# EAGLE schematic APC_100 (EAGLE 7.1.0)
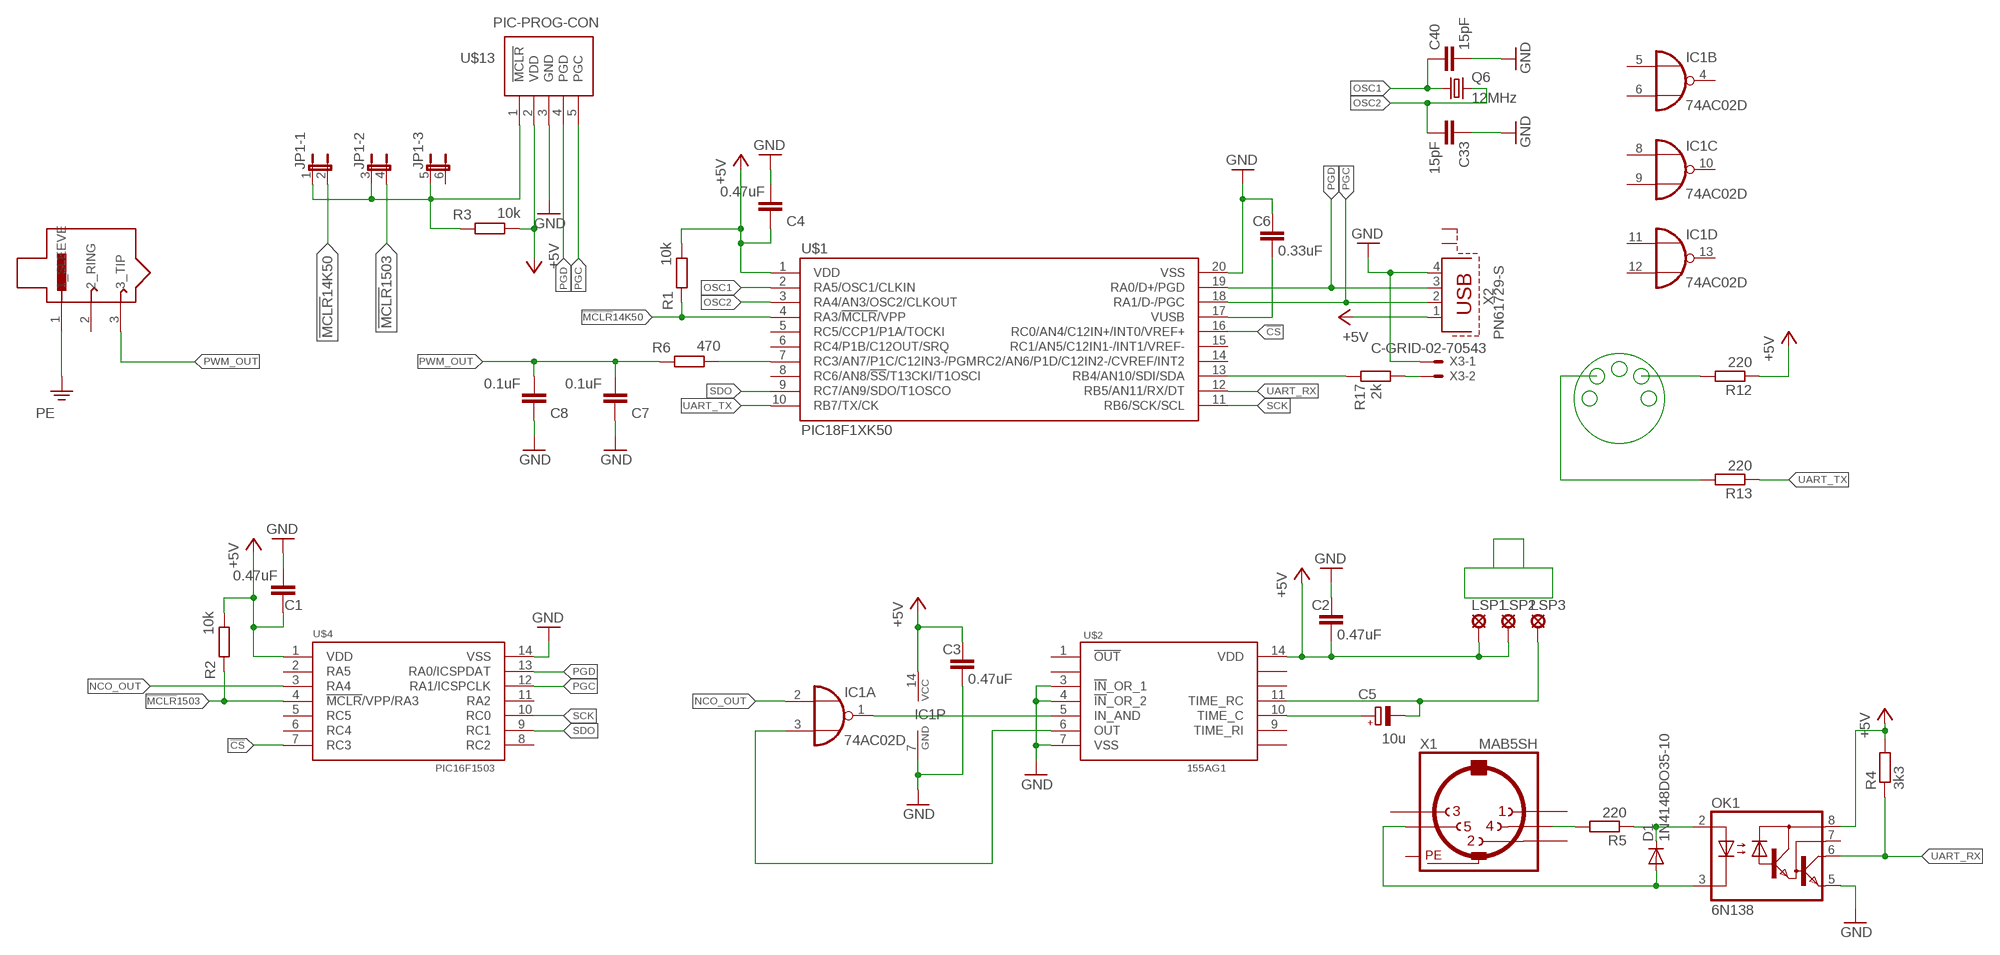
[diagram p0: schematic, sheet 1]

## Parts
C1  0.47uF  C-1206  [C1206]
C2  0.47uF  C-1206  [C1206]
C3  0.47uF  C-1206  [C1206]
C4  0.47uF  C-1206  [C1206]
C5  10u  CPOL-EUCT3528  [CT3528]
C6  0.33uF  C-1206  [C1206]
C7  0.1uF  C-1206  [C1206]
C8  0.1uF  C-1206  [C1206]
C33  15pF  C-1206  [C1206]
C40  15pF  C-1206  [C1206]
D1  1N4148DO35-10  [DO35-10]
IC1  74AC02D  [SO14]
JP1  JP3QE  [JP3Q]
LSP1  SE13  [SE13]
LSP2  SE13  [SE13]
LSP3  SE13  [SE13]
OK1  6N138  [DIL08]
Q6  12MHz  CRYSTALHC49S  [HC49/S]
R1  10k  R-EU_M1206  [M1206]
R2  10k  R-EU_M1206  [M1206]
R3  10k  R-EU_M1206  [M1206]
R4  3k3  R-EU_M1206  [M1206]
R5  220  R-EU_M1206  [M1206]
R6  470  R-EU_M1206  [M1206]
R12  220  R-EU_M1206  [M1206]
R13  220  R-EU_M1206  [M1206]
R17  2k  R-EU_M1206  [M1206]
U$1  PIC18F1XK50  [SOIC20]
U$2  155AG1  [DIP14]
U$3  STEREO_JACK_6.3  [JACK6.3_MAMA_STEREO]
U$4  PIC16F1503  [SO14]
U$13  PIC-PROG-CON  [PIC-PROG-CON]
X1  MAB5SH  [MAB5SH]
X2  PN61729-S  [PN61729-S]
X3  C-GRID-02-70543  [70543-02]

## Nets
!CS: U$1.16(RC0/AN4/C12IN+/INT0/VREF+) U$4.7(RC3)
!MCLR!14K50 [net12]: JP1.2 R1.1 U$1.4(RA3/!MCLR!/VPP)
!MCLR!1503 [net12]: JP1.4 R2.1 U$4.4(!MCLR!/VPP/RA3)
+5V: C1.2 C2.1 C3.2 C4.2 IC1.14(P:VCC) LSP1.MP LSP2.MP OK1.8(VCC) R1.2 R2.2 R3.2 R4.2 R12.1 U$1.1(VDD) U$2.14(VDD) U$4.1(VDD) U$13.2(VDD) X2.1
FIRST_SOUND: IC1.1(A:O) U$2.5(IN_AND)
GND [net8]: C1.1 C2.2 C3.1 C4.1 C6.2 C7.2 C8.2 C33.1 C40.2 IC1.7(P:GND) OK1.5(GND) U$1.20(VSS) U$2.3(!IN!_OR_1) U$2.4(!IN!_OR_2) U$2.7(VSS) U$4.14(VSS) U$13.3(GND) X2.4 X3.1
MCLR [net8]: JP1.1 JP1.3 JP1.5 R3.1 U$13.1(!MCLR)
N$1: C5.+ U$2.10(TIME_C)
N$2: IC1.3(A:I1) U$2.6(OUT)
N$3: C5.- LSP3.MP U$2.11(TIME_RC)
N$4: D1.C OK1.2(A) R5.1
N$5: R5.2 X1.4
N$6: D1.A OK1.3(C) X1.5
N$8: C6.1 U$1.17(VUSB)
N$9 [net16]: R17.1 X3.2
N$10: R17.2 U$1.13(RB4/AN10/SDI/SDA)
N$11: R6.2 U$1.7(RC3/AN7/P1C/C12IN3-/PGM)
N$22: R12.2
N$23: R13.2
NCO_OUT: IC1.2(A:I0) U$4.3(RA4)
OSC1 [net8]: C40.1 Q6.1 U$1.2(RA5/OSC1/CLKIN)
OSC2 [net8]: C33.2 Q6.2 U$1.3(RA4/AN3/OSC2/CLKOUT)
PE: U$3.1(1_SLEEVE)
PGC [net8]: U$1.18(RA1/D-/PGC) U$4.12(RA1/ICSPCLK) U$13.5(PGC) X2.2
PGD [net8]: U$1.19(RA0/D+/PGD) U$4.13(RA0/ICSPDAT) U$13.4(PGD) X2.3
PWM_OUT: C7.1 C8.1 R6.1 U$3.3(3_TIP)
SCK: U$1.11(RB6/SCK/SCL) U$4.10(RC0)
SDO: U$1.9(RC7/AN9/SDO/T1OSCO) U$4.9(RC1)
UART_RX: OK1.6(VO) R4.1 U$1.12(RB5/AN11/RX/DT)
UART_TX: R13.1 U$1.10(RB7/TX/CK)
Unconnected: IC1.4(B:O) IC1.5(B:I0) IC1.6(B:I1) IC1.8(C:I0) IC1.9(C:I1) IC1.10(C:O) IC1.11(D:I0) IC1.12(D:I1) IC1.13(D:O) JP1.6 OK1.7(VB) U$1.5(RC5/CCP1/P1A/TOCKI) U$1.6(RC4/P1B/C12OUT/SRQ) U$1.8(RC6/AN8/!SS!/T13CKI/T1OSCI) U$1.14(RC2/AN6/P1D/C12IN2-/CVREF/INT2) U$1.15(RC1/AN5/C12IN1-/INT1/VREF-) U$2.1(!OUT!) U$2.2(NC) U$2.8(NC) U$2.9(TIME_RI) U$2.12(NC) U$2.13(NC) U$3.2(2_RING) U$4.2(RA5) U$4.5(RC5) U$4.6(RC4) U$4.8(RC2) U$4.11(RA2) X1.1 X1.2 X1.3 X2.S1 X2.S2

## Power pins joined to a net without a drawn wire
PE: X1.PE X1.PE@(PE)

## Library data of the parts
C1-C4 C6-C8 C33 C40 = quantum-sensor:C: Capacitor
C5 = rcl:CPOL-EU: POLARIZED CAPACITOR, European symbol
D1 = diode:1N4148: DIODE high speed (Philips)
IC1 = 74xx-eu:74*02: Quad 2-input NOR gate
JP1 = jumper:JP3QE: JUMPER
LSP1-LSP3 = solpad:SE13: SOLDER PAD E1542, drill 1,3mm, distributor Buerklin, 07F815
OK1 = optocoupler:6N138: MOTOROLA OPTO COUPLER
Q6 = crystal:CRYSTAL: CRYSTAL
R1-R6 R12 R13 R17 = rcl:R-EU_: RESISTOR, European symbol
U$1 = microchip_pic_18f1xK50:PIC18F1XK50: pic pic18 pic18f pic18f13k50 pic18f14k50 pic18f1xk50
U$2 = 155??1:155AG1: 155??1 155AG1
U$3 = connektors:STEREO_JACK_6.3: stereo jack 6.3
U$4 = microchip_pic16f1503:PIC16F1503: pic16f1503
U$13 = pic_prog_con:PIC-PROG-CON: pic prog con pic_prog pic_prog_con
X1 = con-hirschmann:MAB5SH: Female CONNECTOR 5 pins 90 deg. with shield, horizontal (DIN 41524); OC_FARNELL: 809883; OC_NEWARK: unknown
X2 = con-berg:PN61729-S: BERG USB connector
X3 = con-molex:C-GRID-02: CONNECTOR wire to board 2.54 mm (0.100") pitch header; OC_FARNELL: unknown; OC_NEWARK: unknown

## Net classes
2 net12: width 0.305 mm
5 net16: width 0.406 mm
6 net8: width 0.203 mm